# EAGLE design powerdist2 (EAGLE 6.5.0)
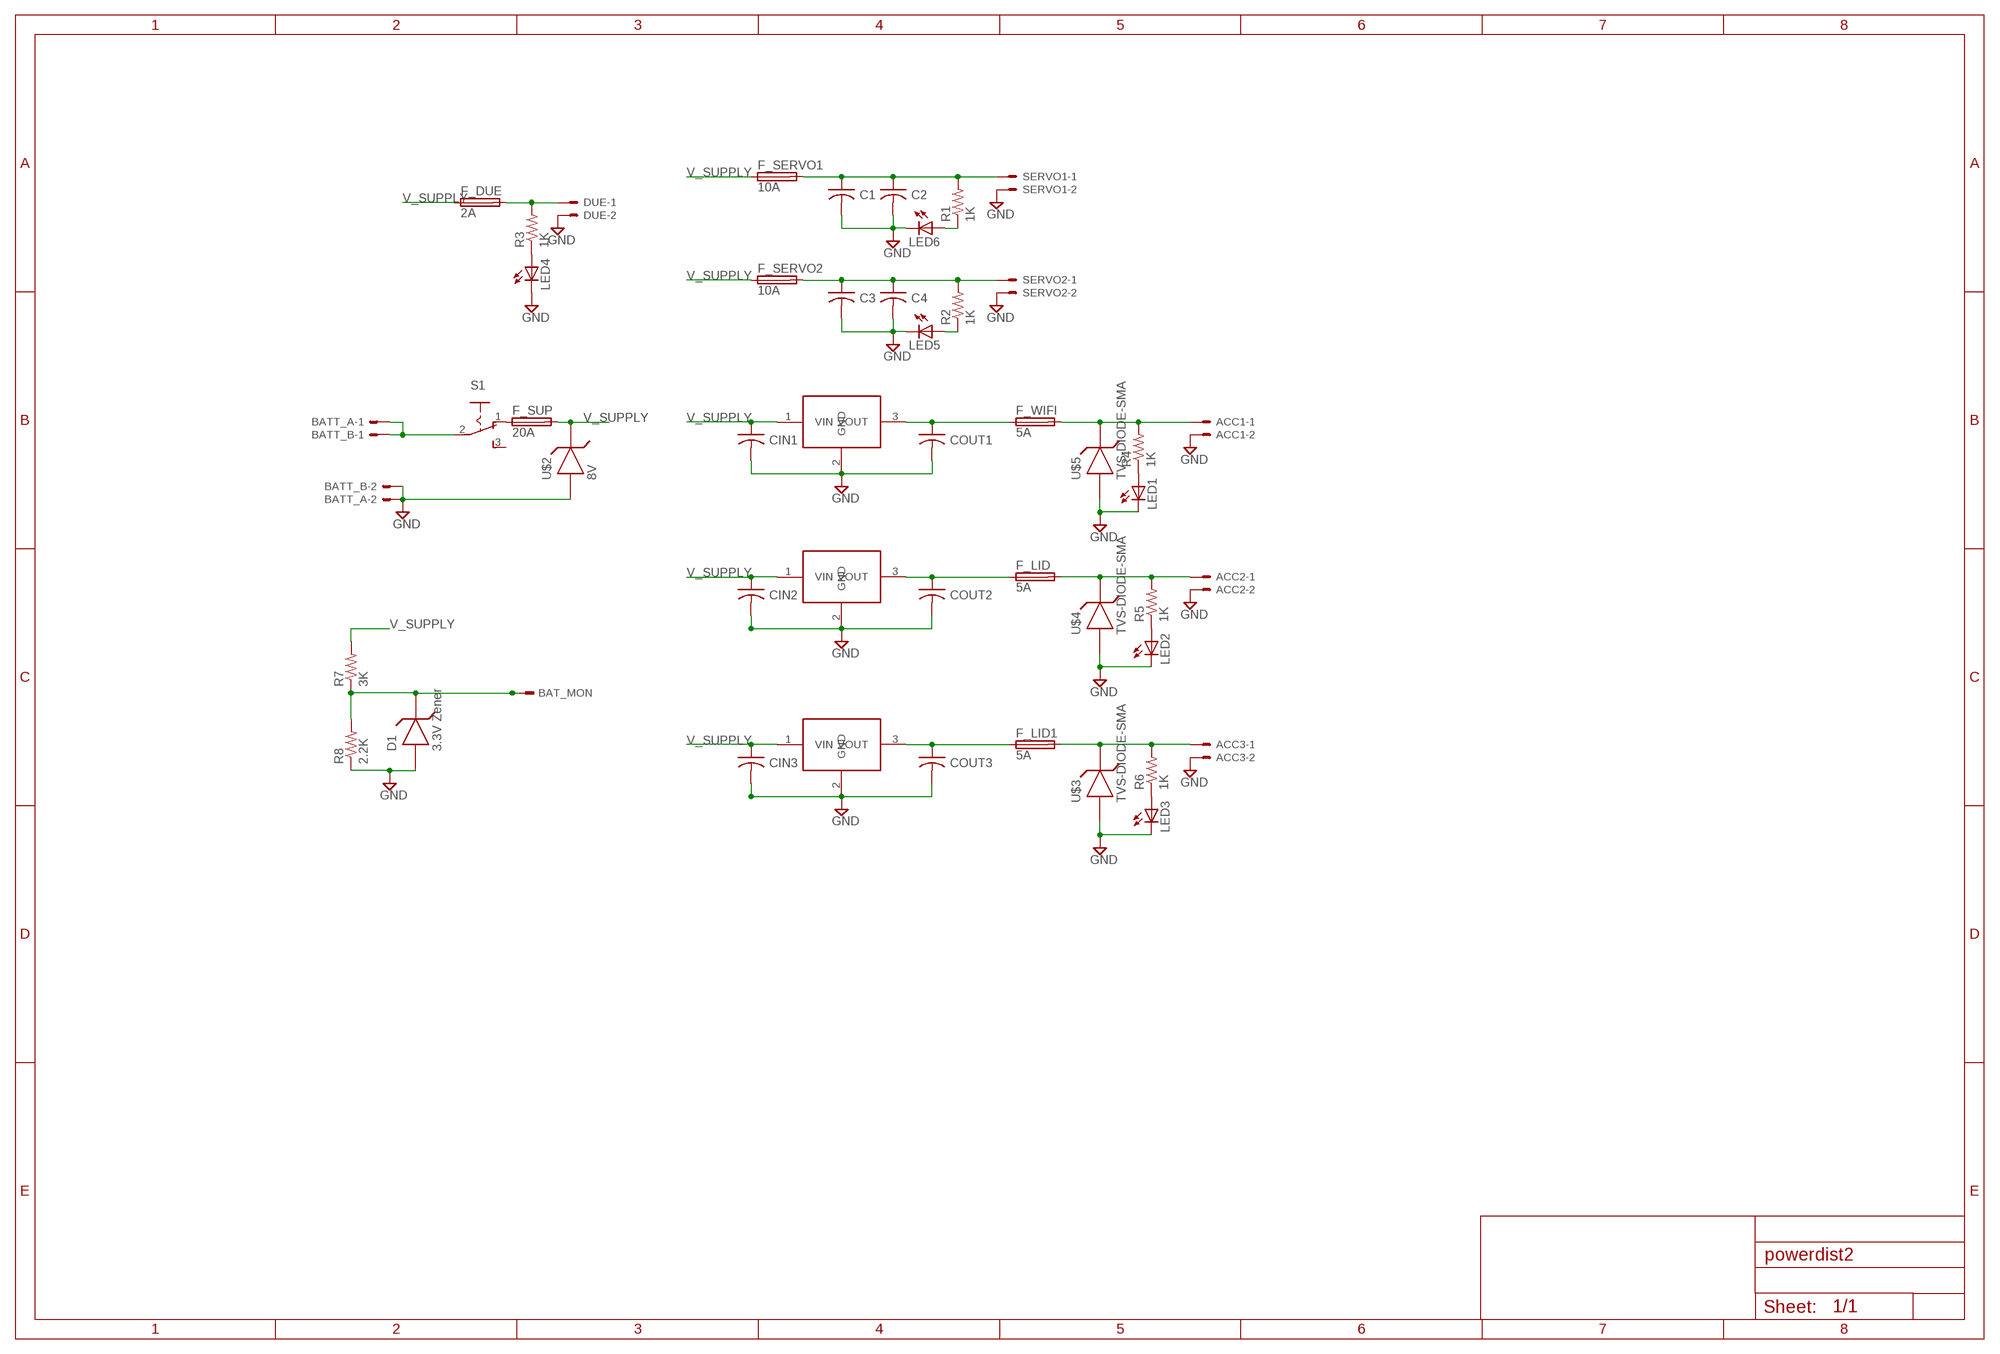
[diagram p0: schematic, sheet 1]

## Parts
ACC1  C-GRID-02-70553  [70553-02]
ACC2  5566-2  [5566-2]
ACC3  5566-2  [5566-2]
BAT_MON  TSW-101-02-S-S  [TSW-101-02-S-S]
BATT_A  22-23-2021  [22-23-2021]
BATT_B  22-23-2021  [22-23-2021]
C1  CAPACITORTH_CAP  [C025-025X050]
C2  CAPACITORTH_CAP  [C025-025X050]
C3  CAPACITORTH_CAP  [C025-025X050]
C4  CAPACITORTH_CAP  [C025-025X050]
CIN1  CAPACITORTH_CAP  [C025-025X050]
CIN2  CAPACITORTH_CAP  [C025-025X050]
CIN3  CAPACITORTH_CAP  [C025-025X050]
COUT1  CAPACITORTH_CAP  [C025-025X050]
COUT2  CAPACITORTH_CAP  [C025-025X050]
COUT3  CAPACITORTH_CAP  [C025-025X050]
D1  3.3V Zener  TVS-DIODE-SMA  [SMA]
DUE  C-GRID-02-70553  [70553-02]
F_DUE  2A  GSH15  [GSH15]
F_LID  5A  GSH15  [GSH15]
F_LID1  5A  GSH15  [GSH15]
F_SERVO1  10A  GSH15  [GSH15]
F_SERVO2  10A  GSH15  [GSH15]
F_SUP  20A  GSH15  [GSH15]
F_WIFI  5A  GSH15  [GSH15]
LED1  LEDCHIP-LED0805  [CHIP-LED0805]
LED2  LEDCHIP-LED0805  [CHIP-LED0805]
LED3  LEDCHIP-LED0805  [CHIP-LED0805]
LED4  LEDCHIP-LED0805  [CHIP-LED0805]
LED5  LEDCHIP-LED0805  [CHIP-LED0805]
LED6  LEDCHIP-LED0805  [CHIP-LED0805]
R1  1K  R-US_0309/10  [0309/10]
R2  1K  R-US_0309/10  [0309/10]
R3  1K  R-US_0309/10  [0309/10]
R4  1K  R-US_0309/10  [0309/10]
R5  1K  R-US_0309/10  [0309/10]
R6  1K  R-US_0309/10  [0309/10]
R7  3K  R-US_0309/10  [0309/10]
R8  2.2K  R-US_0309/10  [0309/10]
S1  255SB  [255SB]
SERVO1  5566-2  [5566-2]
SERVO2  5566-2  [5566-2]
U$1  MIC29150/29300/29500  [TO220]
U$2  8V  TVS-DIODE-SMA  [SMA]
U$3  TVS-DIODE-SMA  [SMA]
U$4  TVS-DIODE-SMA  [SMA]
U$5  TVS-DIODE-SMA  [SMA]
U$6  MIC29150/29300/29500  [TO220]
U$7  MIC29150/29300/29500  [TO220]

## Nets
GND: ACC1.2 ACC2.2 ACC3.2 BATT_A.2 BATT_B.2 C1.2 C2.2 C3.2 C4.2 CIN1.2 CIN2.2 CIN3.2 COUT1.2 COUT2.2 COUT3.2 D1.AN DUE.2 LED1.C LED2.C LED3.C LED4.C LED5.C LED6.C R8.1 SERVO1.2 SERVO2.2 U$1.2(GND) U$2.AN U$3.AN U$4.AN U$5.AN U$6.2(GND) U$7.2(GND)
N$1: C3.1 C4.1 F_SERVO2.2 R2.2 SERVO2.1
N$2: ACC2.1 F_LID.2 R5.2 U$4.CAT
N$4: DUE.1 F_DUE.2 R3.2
N$5: LED6.A R1.1
N$6: COUT1.1 F_WIFI.1 U$7.3(VOUT)
N$7: ACC1.1 F_WIFI.2 R4.2 U$5.CAT
N$8: LED5.A R2.1
N$9: COUT2.1 F_LID.1 U$6.3(VOUT)
N$10: BATT_A.1 BATT_B.1 S1.2(P)
N$11: LED4.A R3.1
N$13: LED1.A R4.1
N$14: F_SUP.1 S1.1(O)
N$15: C1.1 C2.1 F_SERVO1.2 R1.2 SERVO1.1
N$16: LED2.A R5.1
N$18: BAT_MON.1 D1.CAT R7.1 R8.2
N$19: COUT3.1 F_LID1.1 U$1.3(VOUT)
N$21: ACC3.1 F_LID1.2 R6.2 U$3.CAT
N$22: LED3.A R6.1
V_SUPPLY: CIN1.1 CIN2.1 CIN3.1 F_DUE.1 F_SERVO1.1 F_SERVO2.1 F_SUP.2 R7.2 U$1.1(VIN) U$2.CAT U$6.1(VIN) U$7.1(VIN)
Unconnected: S1.3(S)

## Library data of the parts
ACC1 DUE = con-molex:C-GRID-02: CONNECTOR wire to board 2.54 mm (0.100") pitch header; OC_FARNELL: unknown; OC_NEWARK: unknown
ACC2 ACC3 SERVO1 SERVO2 = con-molex:5566-2: Mini FIT connector 2 pol Source: http://www.molex.com; OC_FARNELL: 1822072; OC_NEWARK: unknown
BAT_MON = con-samtec:TSW-101-02-S-S: THROUGH-HOLE .025" SQ POST HEADER Source: Samtec TSW.pdf; OC_FARNELL: unknown; OC_NEWARK: unknown
BATT_A BATT_B = con-molex:22-23-2021: .100" (2.54mm) Center Header - 2 Pin; MF: MOLEX; MPN: 22-23-2021; OC_FARNELL: 1462926; OC_NEWARK: 25C3832
C1-C4 CIN1-CIN3 COUT1-COUT3 = TinyGadget(1):CAPACITOR
D1 U$2-U$5 = Task5:TVS-DIODE: TVS Diode Symbol for use in task 6
F_DUE F_LID F_LID1 F_SERVO1 F_SERVO2 F_SUP F_WIFI = fuse:GSH15: FUSE HOLDER grid 15mm, 19649 Wickmann; MPN: 64900001039; OC_FARNELL: 1271673; OC_NEWARK: 02P0318
LED1-LED6 = led:LED: LED OSRAM: - CHIPLED LG R971, LG N971, LY N971, LG Q971, LY Q971, LO R971, LY R971 LH N974, LH R974 LS Q976, LO Q976, LY Q976 LO Q996 - Hyper CHIPLED LW Q18S LB Q993, LB Q99A, LB R99A - SideLED LS A670, LO A670, LY A670, LG A670, LP A670 LB A673, LV A673, LT A673, LW A673 LH A674 LY A675 LS A676, LA A676, LO A676, LY A676, LW A676 LS A679, LY A679, LG A679 - Hyper Micro SIDELED® LS Y876, LA Y876, LO Y876, LY Y876 LT Y87S - SmartLED LW L88C, LW L88S LB L89C, LB L89S, LG L890 LS L89K, LO L89K, LY L89K LS L896, LA L896, LO L896, LY L896 - TOPLED LS T670, LO T670, LY T670, LG T670, LP T670 LSG T670, LSP T670, LSY T670, LOP T670, LYG T670 LG T671, LOG T671, LSG T671 LB T673, LV T673, LT T673, LW T673 LH T674 LS T676, LA T676, LO T676, LY T676, LB T676, LH T676, LSB T676, LW T676 LB T67C, LV T67C, LT T67C, LS T67K, LO T67K, LY T67K, LW E67C LS E67B, LA E67B, LO E67B, LY E67B, LB E67C, LV E67C, LT E67C LW T67C LS T679, LY T679, LG T679 LS T770, LO T770, LY T770, LG T770, LP T770 LB T773, LV T773, LT T773, LW T773 LH T774 LS E675, LA E675, LY E675, LS T675 LS T776, LA T776, LO T776, LY T776, LB T776 LHGB T686 LT T68C, LB T68C - Hyper Mini TOPLED® LB M676 - Mini TOPLED Santana® LG M470 LS M47K, LO M47K, LY M47K Source: http://www.osram.convergy.de LUXEON: - LUMILED® LXK2-PW12-R00, LXK2-PW12-S00, LXK2-PW14-U00, LXK2-PW14-V00 LXK2-PM12-R00, LXK2-PM12-S00, LXK2-PM14-U00 LXK2-PE12-Q00, LXK2-PE12-R00, LXK2-PE12-S00, LXK2-PE14-T00, LXK2-PE14-U00 LXK2-PB12-K00, LXK2-PB12-L00, LXK2-PB12-M00, LXK2-PB14-N00, LXK2-PB14-P00, LXK2-PB14-Q00 LXK2-PR12-L00, LXK2-PR12-M00, LXK2-PR14-Q00, LXK2-PR14-R00 LXK2-PD12-Q00, LXK2-PD12-R00, LXK2-PD12-S00 LXK2-PH12-R00, LXK2-PH12-S00 LXK2-PL12-P00, LXK2-PL12-Q00, LXK2-PL12-R00 Source: www.luxeon.com KINGBRIGHT: KA-3528ASYC Source: www.kingbright.com
R1-R8 = rcl:R-US_: RESISTOR, American symbol
S1 = switch:255SB: SLIDING SWITCH Distributor Buerklin, 11G810
U$1 U$6 U$7 = Task5:MIC29150/29300/29500

## Board
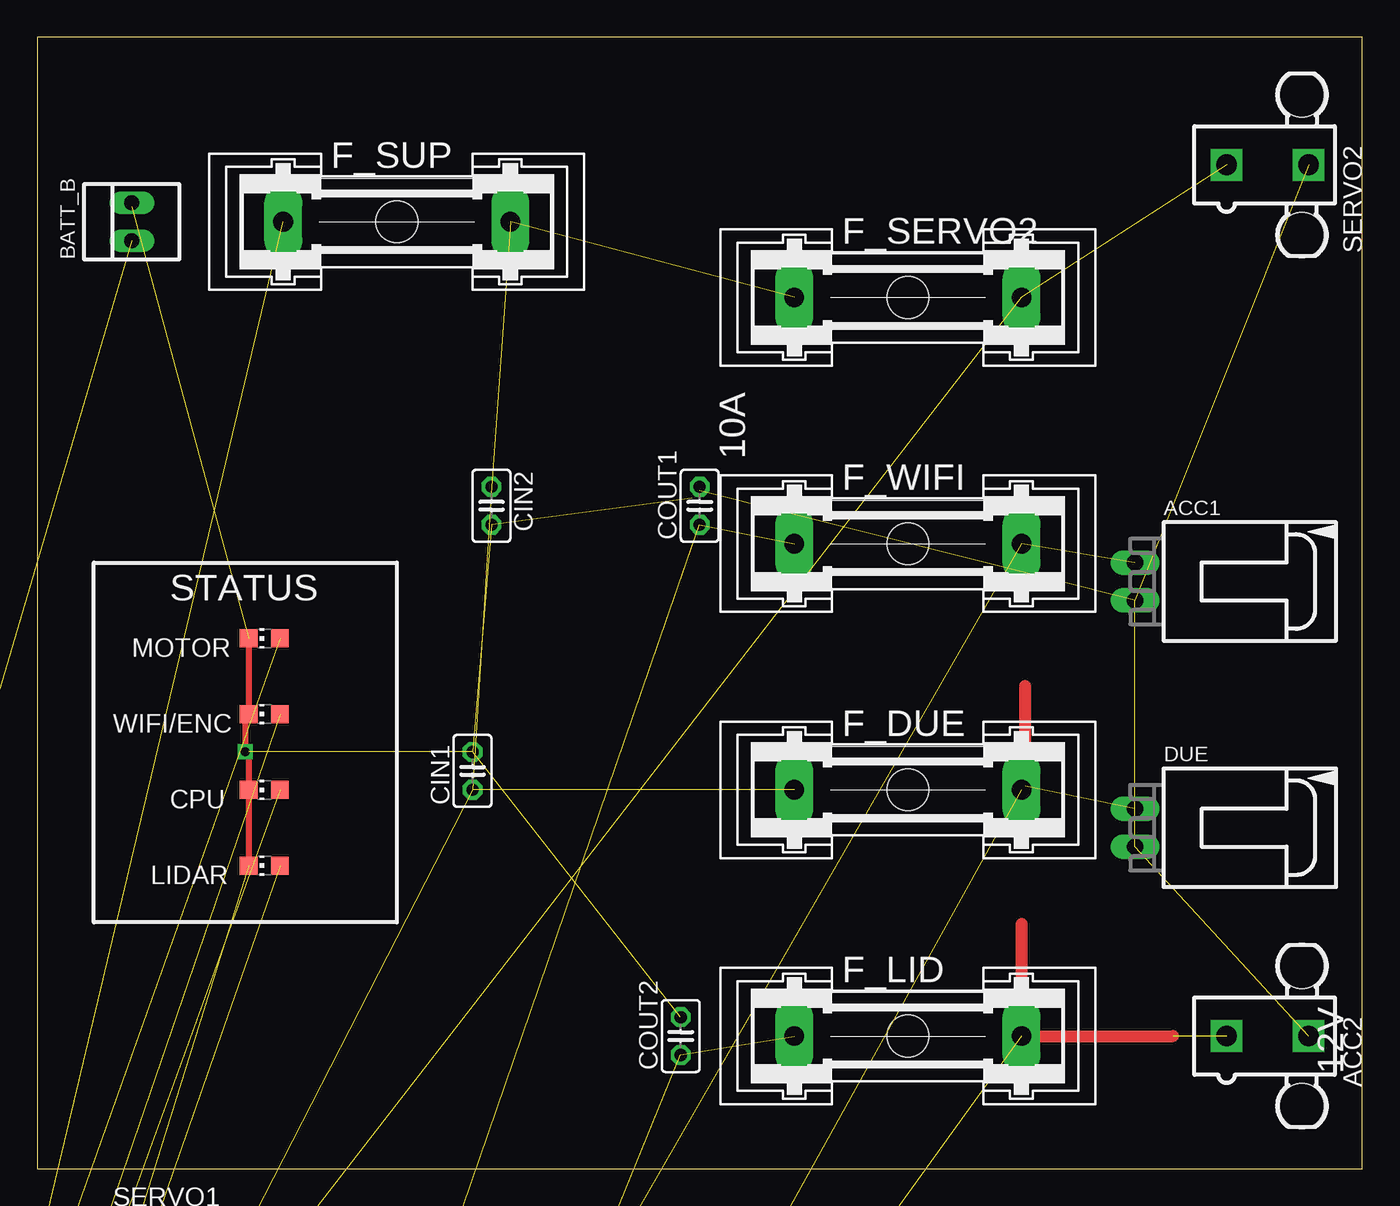
[diagram p1: board, top side]
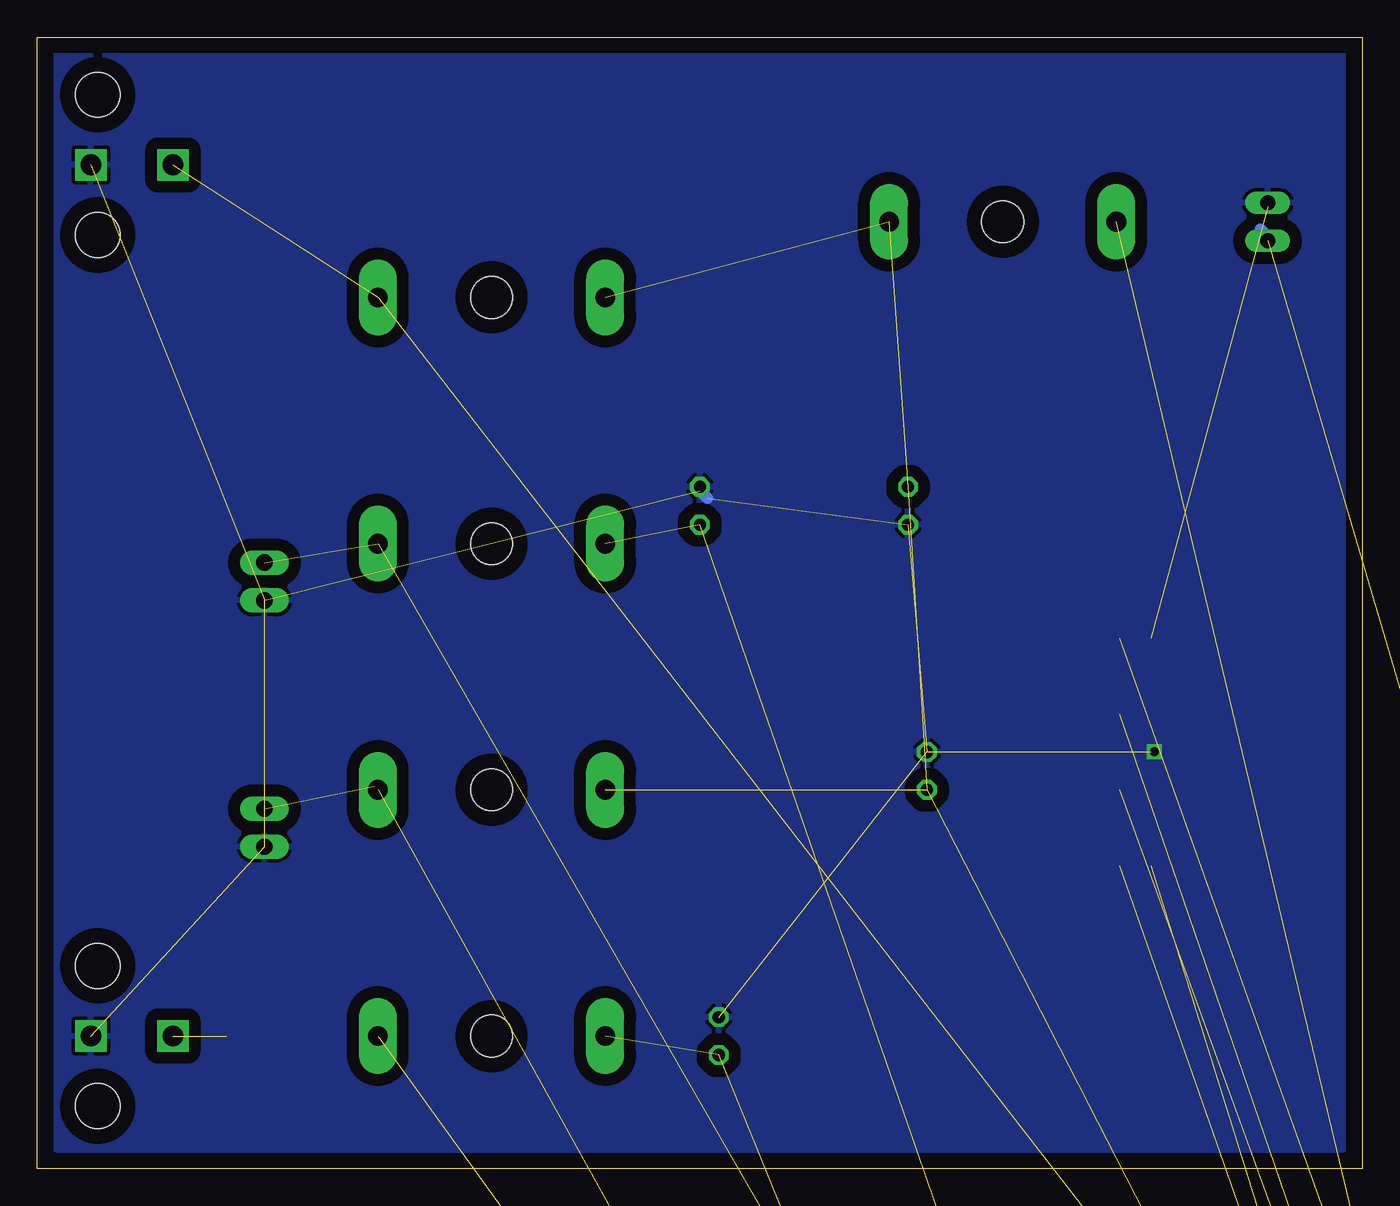
[diagram p2: board, bottom side, seen from below]

Size 88.89 x 75.87 mm. Coordinates in mm from the lower left corner, seen from the top.
Outline: 88.89,0 88.89,75.87 0,75.87 0,0 88.89,0
Copper layers (1*16): Top 0.035mm / dielectric 1.5mm / Bottom 0.035mm
Design rules "default *": minimum track width 30mil, minimum drill 24mil, track to track 8mil, track to pad 8mil, pad to pad 8mil, via to via 8mil, smd to smd 8mil, copper to edge 40mil, drill to drill 8mil, minimum pad ring 10mil, minimum via ring 8mil, stop-mask expansion 4mil, vias tented up to drill 0mil, thermal gap 10mil

### Footprints (pad centres in the part's own frame; a part is rotated, then mirrored left to right if it is on the bottom)
70553-02 = drill 1.092 long: 1 -1.27,-7.62; 2 1.27,-7.62
5566-2 = drill 1.4 square: 1 0,-2.75; 2 0,2.75 | hole 3: 4.7,2.29; -4.7,2.29
TSW-101-02-S-S = drill 1 pad 1.5 octagon: 1 0,0
22-23-2021 = drill 1 long: 1 -1.27,0; 2 1.27,0
C025-025X050 = drill 0.813 octagon: 1 -1.27,0; 2 1.27,0
SMA = smd 1.8 x 2.1: AN 2.05,0; CAT -2.05,0
GSH15 = drill 1.321 pad 2.54 long: 1 -7.62,0; 2 7.62,0 | hole 2.794: 0,0
CHIP-LED0805 = smd 1.2 x 1.2: A 0,-1.05; C 0,1.05
0309/10 = drill 0.813 octagon: 1 -5.08,0; 2 5.08,0
255SB = drill 1.118 long: 1 -3.81,0; 2 0,0; 3 3.81,0
TO220 = drill 1.016 long: 1 -2.54,-2.54; 2 0,-2.54; 3 2.54,-2.54

### Placement (x,y rotation side)
ACC1  81.27,39.37 270 top
ACC2  82.54,8.89 270 top
ACC3  -45.73,-83.82 0 top  (outside the outline)
BAT_MON  -19.06,-53.34 0 top  (outside the outline)
BATT_A  -57.16,-157.48 0 top  (outside the outline)
BATT_B  6.34,63.5 90 top
C1  -11.44,-35.56 0 top  (outside the outline)
C2  -49.54,-66.04 0 top  (outside the outline)
C3  -11.44,-43.18 0 top  (outside the outline)
C4  -49.54,-73.66 0 top  (outside the outline)
CIN1  29.2,26.67 90 top
CIN2  30.47,44.45 270 top
CIN3  -49.54,-114.3 0 top  (outside the outline)
COUT1  44.44,44.45 90 top
COUT2  43.17,8.89 90 top
COUT3  -49.54,-121.92 0 top  (outside the outline)
D1  -48.27,-129.54 0 top  (outside the outline)
DUE  81.27,22.86 270 top
F_DUE  58.41,25.4 0 top
F_LID  58.41,8.89 0 top
F_LID1  -39.38,-97.79 0 top  (outside the outline)
F_SERVO1  12.69,-21.59 0 top  (outside the outline)
F_SERVO2  58.41,58.42 0 top
F_SUP  24.12,63.5 0 top
F_WIFI  58.41,41.91 0 top
LED1  15.23,30.48 90 top
LED2  15.23,20.32 90 top
LED3  -35.57,-86.36 0 top  (outside the outline)
LED4  15.23,25.4 90 top
LED5  15.23,35.56 90 top
LED6  16.5,-11.43 0 top  (outside the outline)
R1  -53.35,-167.64 0 top  (outside the outline)
R2  -53.35,-173.99 0 top  (outside the outline)
R3  -53.35,-180.34 0 top  (outside the outline)
R4  -53.35,-186.69 0 top  (outside the outline)
R5  -53.35,-193.04 0 top  (outside the outline)
R6  -53.35,-199.39 0 top  (outside the outline)
R7  -53.35,-205.74 0 top  (outside the outline)
R8  -53.35,-212.09 0 top  (outside the outline)
S1  -53.35,-246.38 0 top  (outside the outline)
SERVO1  6.34,-7.62 0 top  (outside the outline)
SERVO2  82.54,67.31 270 top
U$1  -54.62,-214.63 0 top  (outside the outline)
U$2  -48.27,-137.16 0 top  (outside the outline)
U$3  -48.27,-144.78 0 top  (outside the outline)
U$4  -48.27,-152.4 0 top  (outside the outline)
U$5  -48.27,-160.02 0 top  (outside the outline)
U$6  -54.62,-223.52 0 top  (outside the outline)
U$7  -54.62,-232.41 0 top  (outside the outline)

### Tracks (layer width: path | path; a pad name or v marks a point on that pad's centre or on a via)
GND  (via drill 0.6)  (29 unrouted)
  Top 0.406: LED5.C LED1.C 13.96,30.48 v13.96,27.94 14.18,27.94 LED4.C LED2.C
  Top 0.762: 6.34,64.52 BATT_B.2
  Bottom 0.762: 43.93,44.96 44.44,45.47 COUT1.2
  pour Bottom (isolate 0.813): 1.26,74.93 87.62,74.93 87.62,1.27 1.26,1.27
N$1  (4 unrouted)
N$2  (3 unrouted)
  Top 0.813: 76.19,8.89 F_LID.2 66.03,16.4
N$4  (2 unrouted)
  Top 0.762: 66.28,25.65 F_DUE.2
  Top 0.813: 66.28,25.65 66.28,32.37
  Bottom 0.762: 66.28,25.65 F_DUE.2
N$5  (1 unrouted)
N$6  (2 unrouted)
  Top 0.762: 44.44,43.43 COUT1.1
  Bottom 0.762: 44.44,43.43 COUT1.1
N$7  (3 unrouted)
N$8  (1 unrouted)
N$9  (2 unrouted)
N$10  (2 unrouted)
  Bottom 0.762: 6.85,62.99 6.34,62.48 BATT_B.1
N$11  (1 unrouted)
N$13  (1 unrouted)
N$14  (1 unrouted)
N$15  (4 unrouted)
N$16  (1 unrouted)
N$18  (3 unrouted)
N$19  (2 unrouted)
N$21  (3 unrouted)
N$22  (1 unrouted)
V_SUPPLY  (11 unrouted)

### Text on the board
tPlace: 10A | 12V
tNames: STATUS | MOTOR | WIFI/ENC | CPU | LIDAR